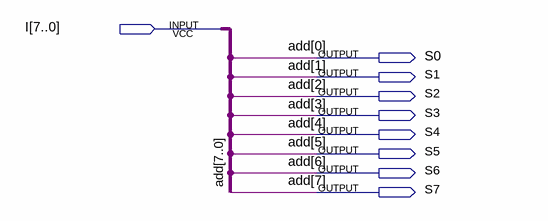
[diagram p0: schematic sheet]
// Quartus schematic vetor7_1.bdf as structural Verilog: 0 symbols, 9 pins
module vetor7_1 (
  input  [7:0] I,
  output S0,
  output S1,
  output S2,
  output S3,
  output S4,
  output S5,
  output S6,
  output S7
);


  assign S0 = I[0];
  assign S1 = I[1];
  assign S2 = I[2];
  assign S3 = I[3];
  assign S4 = I[4];
  assign S5 = I[5];
  assign S6 = I[6];
  assign S7 = I[7];

  // Other names for the same wires on the sheet: add[7:0] = I
endmodule
